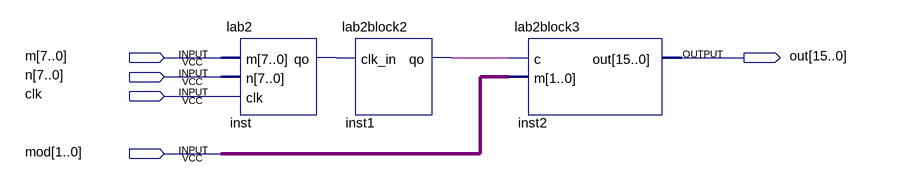
[diagram p0: schematic sheet]
// Quartus schematic obsch.bdf as structural Verilog: 3 symbols, 5 pins
module obsch (
  input  [7:0] m,
  input  [7:0] n,
  input  clk,
  input  [1:0] mod,
  output [15:0] out
);

  wire inst1_qo, inst_qo;

  lab2 inst (.m(m), .n(n), .clk(clk), .qo(inst_qo));
  lab2block2 inst1 (.clk_in(inst_qo), .qo(inst1_qo));
  lab2block3 inst2 (.c(inst1_qo), .m(mod), .out(out));
endmodule
